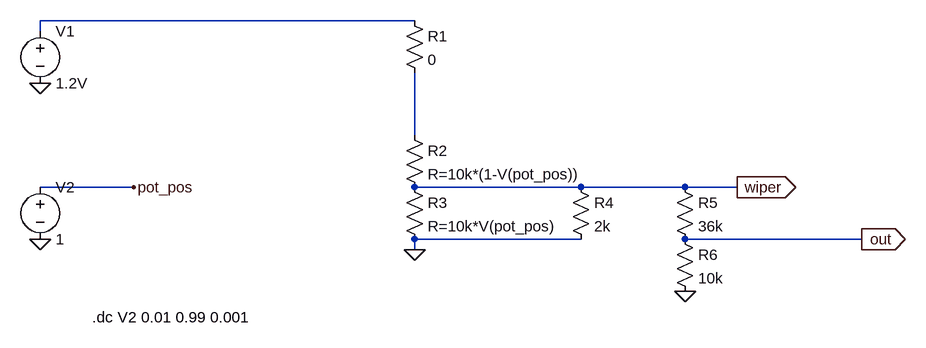
[diagram p0: schematic nonlinear_pot.asc]
nonlinear_pot.asc, the LTspice schematic file:
Version 4
SHEET 1 1336 680
WIRE 544 16 -32 16
WIRE -32 32 -32 16
WIRE 544 192 544 96
WIRE 112 272 -32 272
WIRE 800 272 544 272
WIRE 960 272 800 272
WIRE 1040 272 960 272
WIRE 800 352 544 352
WIRE 1232 352 960 352
WIRE 544 368 544 352
FLAG -32 112 0
FLAG -32 352 0
FLAG 1040 272 wiper
IOPIN 1040 272 Out
FLAG 112 272 pot_pos
FLAG 544 368 0
FLAG 960 432 0
FLAG 1232 352 out
IOPIN 1232 352 Out
SYMBOL voltage -32 16 R0
WINDOW 123 0 0 Left 2
WINDOW 39 0 0 Left 2
SYMATTR InstName V1
SYMATTR Value 1.2V
SYMBOL voltage -32 256 R0
WINDOW 123 0 0 Left 2
WINDOW 39 0 0 Left 2
SYMATTR InstName V2
SYMATTR Value 1
SYMBOL res 528 0 R0
SYMATTR InstName R1
SYMATTR Value 0
SYMBOL res 528 176 R0
SYMATTR InstName R2
SYMATTR Value R=10k*(1-V(pot_pos))
SYMBOL res 528 256 R0
SYMATTR InstName R3
SYMATTR Value R=10k*V(pot_pos)
SYMBOL res 784 256 R0
SYMATTR InstName R4
SYMATTR Value 2k
SYMBOL res 944 256 R0
SYMATTR InstName R5
SYMATTR Value 36k
SYMBOL res 944 336 R0
SYMATTR InstName R6
SYMATTR Value 10k
TEXT 48 472 Left 2 !.dc V2 0.01 0.99 0.001

The netlist it stands for:
* nonlinear_pot.asc
V1 N001 0 1.2V
V2 pot_pos 0 1
R1 N001 N002 0
R2 N002 wiper R=10k*(1-V(pot_pos))
R3 wiper 0 R=10k*V(pot_pos)
R4 wiper 0 2k
R5 wiper out 36k
R6 out 0 10k
.dc V2 0.01 0.99 0.001
.backanno
.end